# EAGLE design pearwatch-bottom (EAGLE 9.5.2)
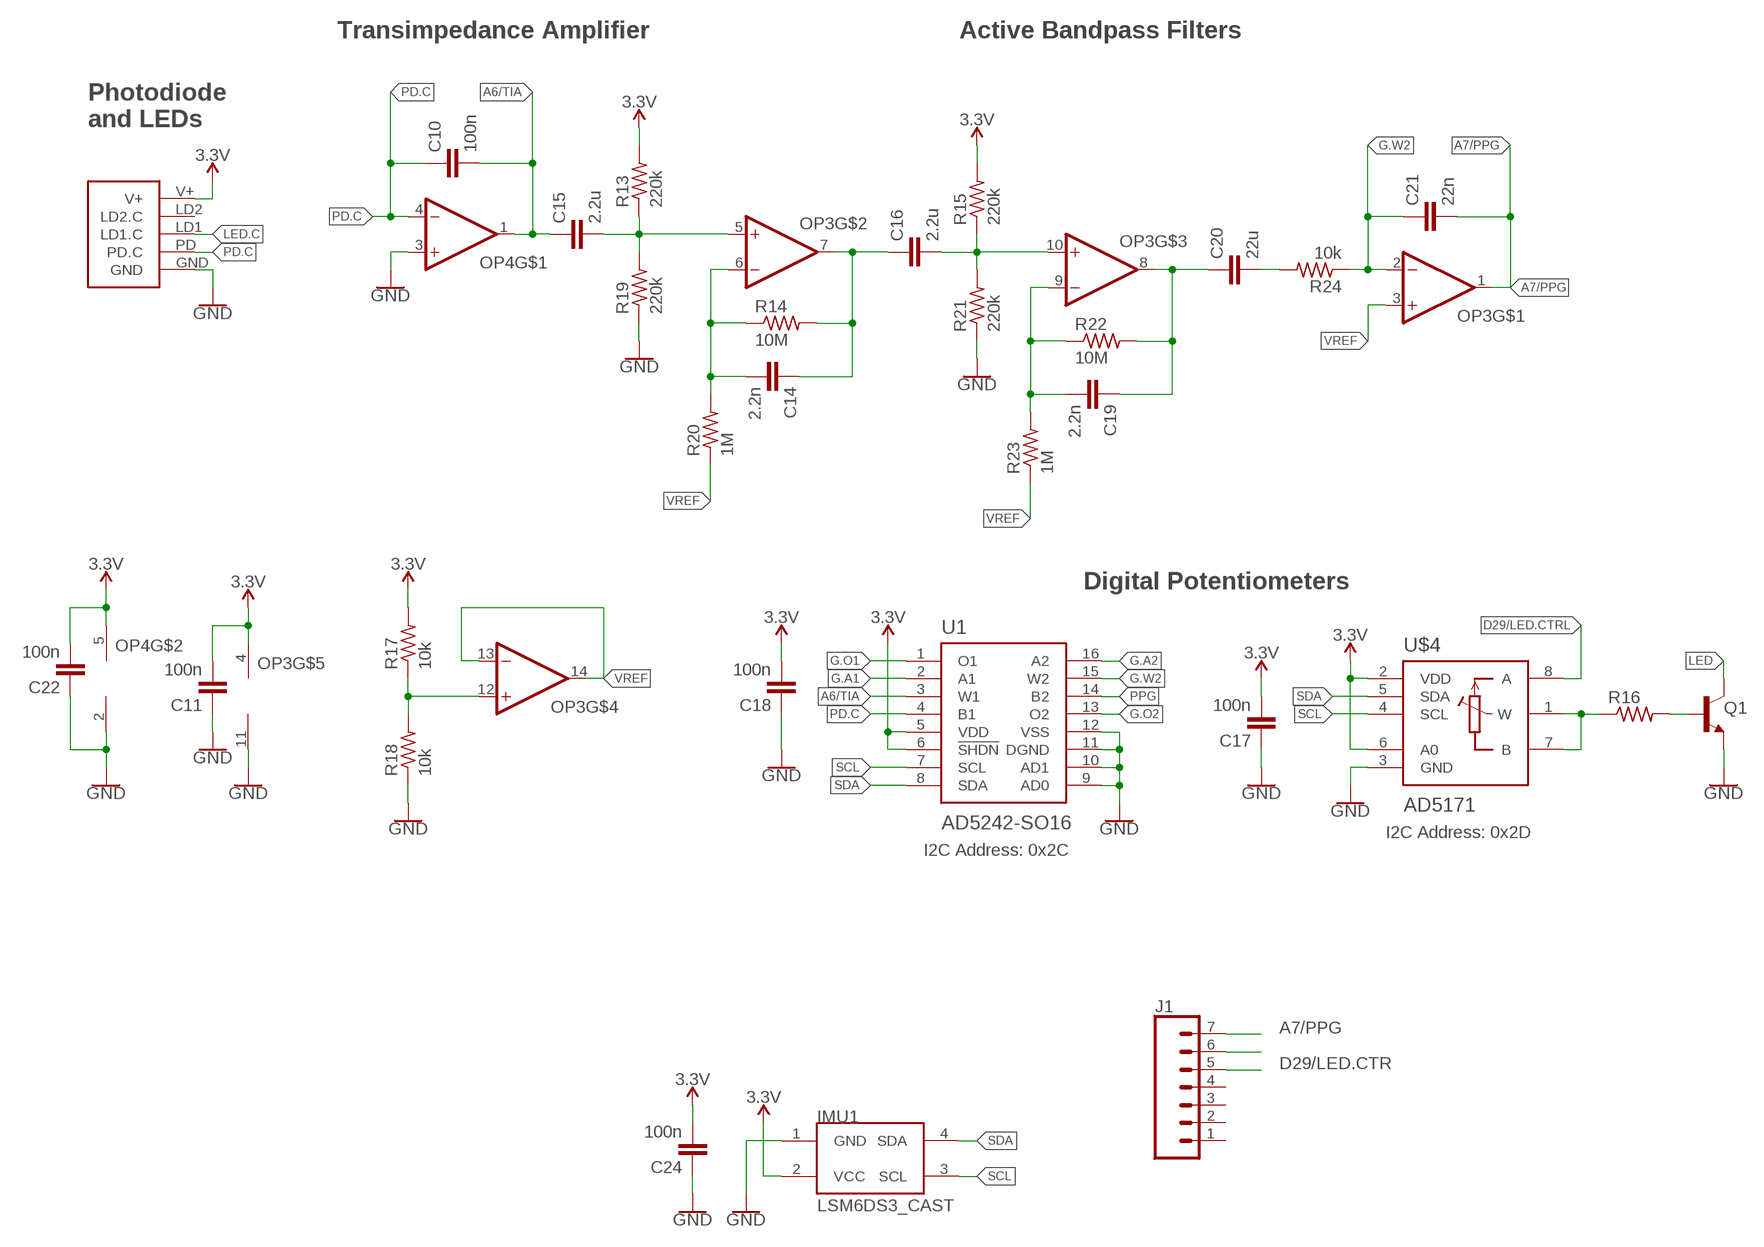
[diagram p0: schematic, sheet 1]

## Parts
C10  100n  CAPACITOR0603  [C0603]
C11  100n  CAPACITOR0603  [C0603]
C14  2.2n  CAPACITOR0603  [C0603]
C15  2.2u  CAPACITOR0603  [C0603]
C16  2.2u  CAPACITOR0603  [C0603]
C17  100n  CAPACITOR0603  [C0603]
C18  100n  CAPACITOR0603  [C0603]
C19  2.2n  CAPACITOR0603  [C0603]
C20  22u  CAPACITOR0603  [C0603]
C21  22n  CAPACITOR0603  [C0603]
C22  100n  CAPACITOR0603  [C0603]
C24  100n  CAPACITOR0603  [C0603]
IMU1  LSM6DS3_CAST  [LSM6DS3_CAST]
J1  CONN_07  [1X07]
OP3  OP-QUAD-SO14  [SO14]
OP4  OP-SINGLEOT  [SOT23-5]
Q1  NPN-GENERIC  [SOT23-3]
R13  220k  RESISTOR0603  [R0603]
R14  10M  RESISTOR0603  [R0603]
R15  220k  RESISTOR0603  [R0603]
R16  RESISTOR0603  [R0603]
R17  10k  RESISTOR0402  [R0402]
R18  10k  RESISTOR0402  [R0402]
R19  220k  RESISTOR0603  [R0603]
R20  1M  RESISTOR0603  [R0603]
R21  220k  RESISTOR0603  [R0603]
R22  10M  RESISTOR0603  [R0603]
R23  1M  RESISTOR0603  [R0603]
R24  10k  RESISTOR0603  [R0603]
U1  AD5242-SO16  [SO16]
U$3  PPG.MODULE.2  [PPG.MODULE.2]
U$4  AD5171  [SOT-23-8]

## Nets
3.3V: C11.2 C17.2 C18.2 C22.2 C24.2 IMU1.2(VCC) OP3.4(V+) OP4.5(V+) R13.2 R15.2 R17.2 U1.5(VDD) U1.6(!SHDN) U$3.V+ U$4.2(VDD) U$4.6(A0)
A6/TIA: C10.2 C15.1 J1.5 OP4.1(OUT) U1.3(W1)
A7/PPG: C21.2 J1.7 OP3.1(OUT)
D29/LED.CTR: J1.6
D29/LED.CTRL: U$4.8(A)
G.A1: U1.2(A1)
G.A2: U1.16(A2)
G.O1: U1.1(O1)
G.O2: U1.13(O2)
G.W2: C21.1 OP3.2(-IN) R24.1 U1.15(W2)
GND: C11.1 C17.1 C18.1 C22.1 C24.1 IMU1.1(GND) OP3.11(V-) OP4.2(V-) OP4.3(+IN) Q1.2(E) R18.1 R19.1 R21.1 U1.9(AD0) U1.10(AD1) U1.11(DGND) U1.12(VSS) U$3.GND U$4.3(GND)
LED: Q1.3(C)
LED.C: U$3.LD1(LD1.C)
N$8: Q1.1(B) R16.2
N$9: R16.1 U$4.1(W) U$4.7(B)
N$10: OP3.12(+IN) R17.1 R18.2
N$13: C15.2 OP3.5(+IN) R13.1 R19.2
N$15: C14.2 OP3.6(-IN) R14.1 R20.2
N$16: C14.1 C16.1 OP3.7(OUT) R14.2
N$17: C16.2 OP3.10(+IN) R15.1 R21.2
N$18: C19.2 OP3.9(-IN) R22.1 R23.2
N$19: C19.1 C20.1 OP3.8(OUT) R22.2
N$20: C20.2 R24.2
PD.C: C10.1 OP4.4(-IN) U1.4(B1) U$3.PD(PD.C)
PPG: U1.14(B2)
SCL: IMU1.3(SCL) U1.7(SCL) U$4.4(SCL)
SDA: IMU1.4(SDA) U1.8(SDA) U$4.5(SDA)
VREF: OP3.3(+IN) OP3.13(-IN) OP3.14(OUT) R20.1 R23.1
Unconnected: J1.1 J1.2 J1.3 J1.4 U$3.LD2(LD2.C)

## Notes on the sheet
- Transimpedance Amplifier | Active Bandpass Filters
- Photodiode
  and LEDs
- Digital Potentiometers
- I2C Address: 0x2D
- I2C Address: 0x2C

## Library data of the parts
C10 C11 C14-C22 C24 = LinnesLab-Passives:CAPACITOR
IMU1 = LinnesLab-Sensors:LSM6DS3_CAST
J1 = LinnesLab-Connectors:CONN_07: Multi connection point. Often used as Generic Header-pin footprint for 0.1 inch spaced/style header connections On any of the 0.1 inch spaced packages, you can populate with these: Break Away Headers - Straight <https://www.sparkfun.com/products/116> (PRT-00116) Break Away Male Headers - Right Angle <https://www.sparkfun.com/products/553> (PRT-00553) Female Headers <https://www.sparkfun.com/products/115> (PRT-00115) Break Away Headers - Machine Pin <https://www.sparkfun.com/products/117> (PRT-00117) Break Away Female Headers - Swiss Machine Pin <https://www.sparkfun.com/products/743> (PRT-00743) For SCREWTERMINALS and SPRING TERMINALS visit here: Screw Terimnals on SparkFun.com <https://www.sparkfun.com/search/results?term=Screw+Terminals> (5mm/3.5mm/2.54mm spacing) This device is also useful as a general connection point to wire up your design to another part of your project. Our various solder wires solder well into these plated through hole pads. Hook-Up Wire - Assortment (Stranded, 22 AWG) <https://www.sparkfun.com/products/11375> (PRT-11375) Hook-Up Wire - Assortment (Solid Core, 22 AWG) <https://www.sparkfun.com/products/11367> (PRT-11367) View the entire wire category on our website here <https://www.sparkfun.com/categories/141> Special notes: Molex polarized connector foot print use with SKU : PRT-08231 with associated crimp pins and housings. 1MM SMD Version SKU: PRT-10208 NOTES ON THE VARIANTS LOCK and LOCK_LONGPADS... This footprint was designed to help hold the alignment of a through-hole component (i.e. 6-pin header) while soldering it into place. You may notice that each hole has been shifted either up or down by 0.005 of an inch from it's more standard position (which is a perfectly straight line). This slight alteration caused the pins (the squares in the middle) to touch the edges of the holes. Because they are alternating, it causes a "brace" to hold the component in place. 0.005 has proven to be the perfect amount of "off-center" position when using our standard breakaway headers. Although looks a little odd when you look at the bare footprint, once you have a header in there, the alteration is very hard to notice. Also,if you push a header all the way into place, it is covered up entirely on the bottom side.
OP3 = LinnesLab-AnalogIC:OP-QUAD: General symbol and footprints for Quad Op Amps. Use with any standard general purpose op amp.
OP4 = LinnesLab-AnalogIC:OP-SINGLE: Single Op Amp 2.7V to 6.0V Single Supply CMOS Source: http://ww1.microchip.com/downloads/en/DeviceDoc/21314g.pdf
Q1 = LinnesLab-DiscreteSemi:NPN
R13-R24 = LinnesLab-Passives:RESISTOR
U1 = LinnesLab-DigitalIC:AD5242
U$3 = LinnesLab-Connectors:PPG.MODULE.2: Digi-Key Part Number: S9014E-50-ND Manufacturer Part Number: GRPB501VWVN-RC Description: 1mm insulation height 0.05in pitch 50 positions
U$4 = LinnesLab-DigitalIC:AD5171

## Board
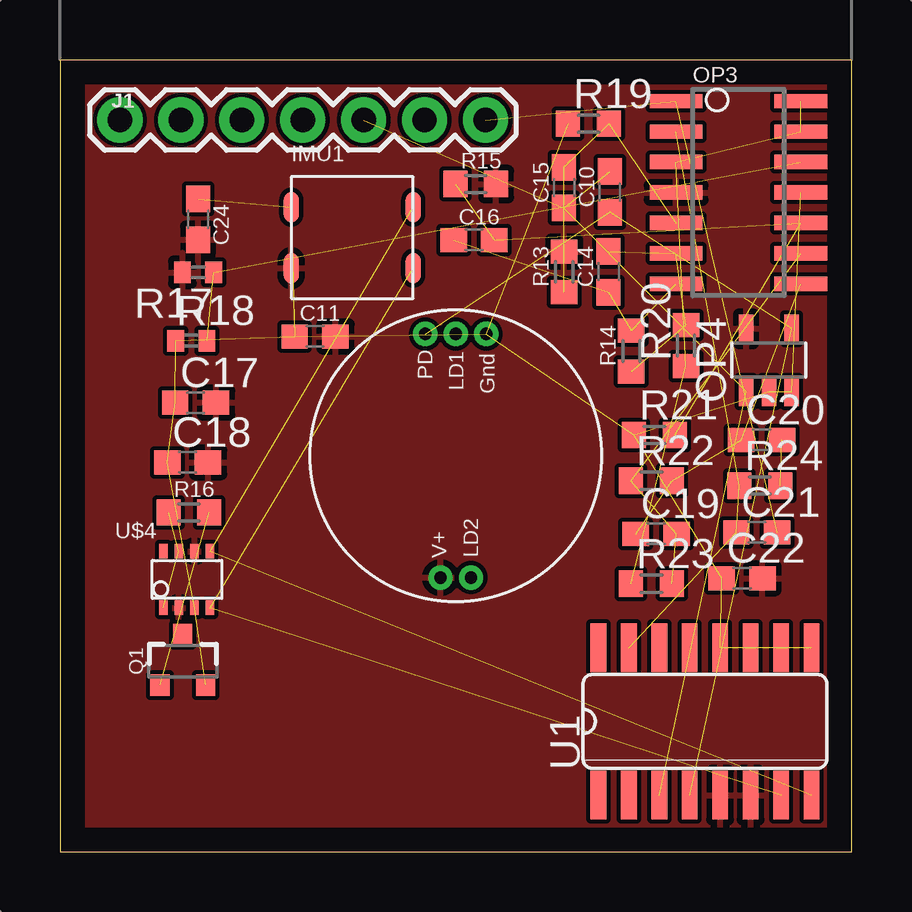
[diagram p1: board, top side]

Size 33 x 33 mm. Coordinates in mm from the lower left corner, seen from the top.
Outline: 0,0 33,0 33,33 0,33 0,0
Copper layers (1*16): Top 0.035mm / dielectric 1.5mm / Bottom 0.035mm
Design rules "default": minimum track width 6mil, minimum drill 0.35mm, track to track 6mil, track to pad 6mil, pad to pad 6mil, via to via 6mil, smd to smd 6mil, copper to edge 40mil, drill to drill 6mil, minimum pad ring 10mil, minimum via ring 8mil, stop-mask expansion 4mil, vias tented up to drill 0mil, thermal gap 10mil

### Footprints (pad centres in the part's own frame; a part is rotated, then mirrored left to right if it is on the bottom)
C0603 = smd 1.1 x 1: 1 -0.85,0; 2 0.85,0
LSM6DS3_CAST = smd 0.635 x 1.27: 1 -2.54,1.27; 2 -2.54,-1.27; 3 2.54,-1.27; 4 2.54,1.27
1X07 = drill 1.016 pad 1.88: 1 0,0; 2 2.54,0; 3 5.08,0; 4 7.62,0; 5 10.16,0; 6 12.7,0; 7 15.24,0
SO14 = smd 0.6 x 2.2: 1 -3.81,-2.6; 2 -2.54,-2.6; 3 -1.27,-2.6; 4 0,-2.6; 5 1.27,-2.6; 6 2.54,-2.6; 7 3.81,-2.6; 8 3.81,2.6; 9 2.54,2.6; 10 1.27,2.6; 11 0,2.6; 12 -1.27,2.6; 13 -2.54,2.6; 14 -3.81,2.6
SOT23-5 = smd 0.6 x 1.2: 1 -0.95,-1.306; 2 0,-1.306; 3 0.95,-1.306; 4 0.95,1.306; 5 -0.95,1.306
SOT23-3 = smd 0.8 x 0.9: 1 -0.95,-1; 2 0.95,-1; 3 0,1.1
R0603 = smd 1 x 1.1: 1 -0.85,0; 2 0.85,0
R0402 = smd 0.7 x 0.9: 1 -0.65,0; 2 0.65,0
SO16 = smd 0.66 x 2.032: 1 -4.445,-3.073; 2 -3.175,-3.073; 3 -1.905,-3.073; 4 -0.635,-3.073; 5 0.635,-3.073; 6 1.905,-3.073; 7 3.175,-3.073; 8 4.445,-3.073; 9 4.445,3.073; 10 3.175,3.073; 11 1.905,3.073; 12 0.635,3.073; 13 -0.635,3.073; 14 -1.905,3.073; 15 -3.175,3.073; 16 -4.445,3.073
PPG.MODULE.2 = drill 0.508 pad 0.94: GND 1.27,5.08; LD1 0,5.08; LD2 0.635,-5.08; PD -1.27,5.08; V+ -0.635,-5.08
SOT-23-8 = smd 0.35 x 0.6: 1 -0.991,-1.176; 2 -0.341,-1.176; 3 0.309,-1.176; 4 0.959,-1.176; 5 0.959,1.176; 6 0.309,1.176; 7 -0.341,1.176; 8 -0.991,1.176

### Placement (x,y rotation side)
C10  22.93,27.5 90 top
C11  10.63,21.48 0 top
C14  22.87,24.17 90 top
C15  21.02,27.68 90 top
C16  17.26,25.49 0 top
C17  5.65,18.71 0 top
C18  5.32,16.22 0 top
C19  24.86,13.25 0 top
C20  29.25,17.16 0 top
C21  29.05,13.3 0 top
C22  28.44,11.39 0 top
C24  5.76,26.35 270 top
IMU1  12.18,25.59 0 top
J1  2.5,30.5 0 top
OP3  28.28,27.47 270 top
OP4  29.55,20.49 0 top
Q1  5.12,7.94 0 top
R13  21.02,24.17 90 top
R14  23.81,20.87 90 top
R15  17.34,27.83 0 top
R16  5.37,14.14 0 top
R17  5.76,24.14 180 top
R18  5.48,21.3 0 top
R19  22.04,30.34 0 top
R20  26.1,21.1 90 top
R21  24.78,17.36 0 top
R22  24.65,15.46 0 top
R23  24.65,11.17 0 top
R24  29.17,15.25 0 top
U1  26.89,5.42 0 top
U$3  16.5,16.5 0 top
U$4  5.3,11.34 0 top

### Tracks (layer width: path | path; a pad name or v marks a point on that pad's centre or on a via)
3.3V
  pour Top (isolate 0.178): 0.37,32.55 32.6,32.55 32.6,0.45 0.37,0.45
A6/TIA  (4 unrouted)
A7/PPG  (2 unrouted)
G.W2  (3 unrouted)
GND  (18 unrouted)
N$8  (1 unrouted)
N$9  (2 unrouted)
N$10  (2 unrouted)
N$13  (3 unrouted)
N$15  (3 unrouted)
N$16  (3 unrouted)
N$17  (3 unrouted)
N$18  (3 unrouted)
N$19  (3 unrouted)
N$20  (1 unrouted)
PD.C  (3 unrouted)
SCL  (2 unrouted)
SDA  (2 unrouted)
VREF  (4 unrouted)